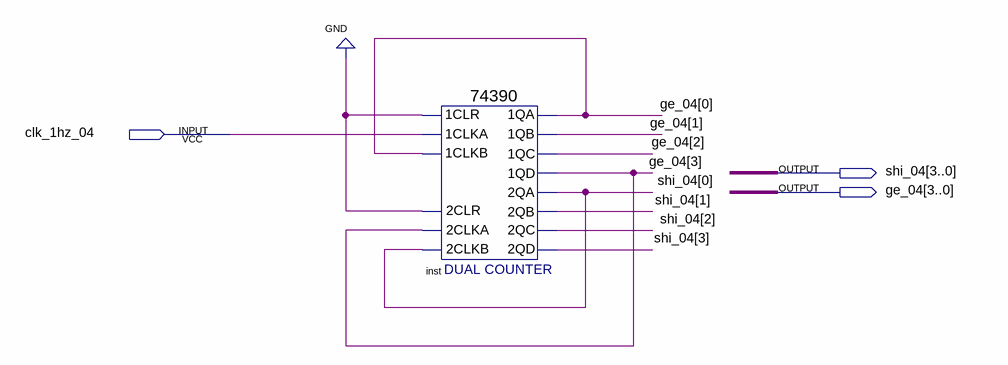
[diagram p0: schematic sheet]
// Quartus schematic counter_output_04.bdf as structural Verilog: 1 symbols, 3 pins
module counter_output_04 (
  input  clk_1hz_04,
  output [3:0] shi_04,
  output [3:0] ge_04
);

  \74390  inst (
    .\2CLKA (ge_04[3]), .\2CLR (1'b0), .\2CLKB (shi_04[0]), .\1CLR (1'b0), .\1CLKA (clk_1hz_04),
    .\1CLKB (ge_04[0]), .\1QA (ge_04[0]), .\1QB (ge_04[1]), .\1QC (ge_04[2]), .\1QD (ge_04[3]),
    .\2QA (shi_04[0]), .\2QB (shi_04[1]), .\2QC (shi_04[2]), .\2QD (shi_04[3]));
endmodule
